# Altium schematic sheet VESC_75100.SchDoc
size A4
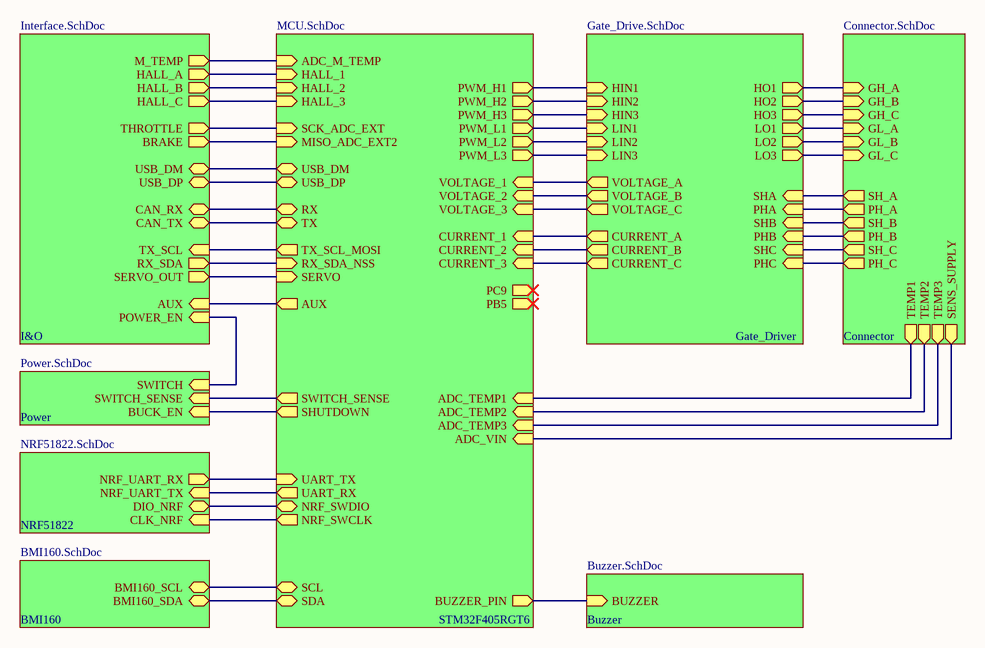
[diagram p0: VESC_75100.SchDoc]

## Sub-sheets
BMI160 = BMI160.SchDoc: BMI160_SCL (bidir), BMI160_SDA (bidir)
Buzzer = Buzzer.SchDoc: BUZZER (in)
Connector = Connector.SchDoc: TEMP1 (out), TEMP2 (out), TEMP3 (out), SH_A (out), SH_B (out), SH_C (out), PH_B (out), PH_C (out), PH_A (out), GL_A (in), GL_B (in), GL_C (in), GH_A (in), GH_B (in), GH_C (in), SENS_SUPPLY (out)
Gate_Driver = Gate_Drive.SchDoc: HIN3 (in), LIN3 (in), LIN1 (in), LIN2 (in), HIN1 (in), HIN2 (in), HO1 (out), HO2 (out), HO3 (out), LO1 (out), LO2 (out), LO3 (out), CURRENT_A (out), CURRENT_B (out), CURRENT_C (out), VOLTAGE_C (out), VOLTAGE_B (out), VOLTAGE_A (out), SHA (in), PHA (in), SHB (in), PHB (in), SHC (in), PHC (in)
I&O = Interface.SchDoc: CAN_TX (bidir), CAN_RX (bidir), USB_DP (bidir), USB_DM (bidir), SERVO_OUT (out), RX_SDA (out), TX_SCL (in), HALL_A (out), HALL_B (out), HALL_C (out), M_TEMP (out), POWER_EN (in), BRAKE (out), THROTTLE (out), AUX (in)
NRF51822 = NRF51822.SchDoc: NRF_UART_RX (out), NRF_UART_TX (in), DIO_NRF (bidir), CLK_NRF (in)
Power = Power.SchDoc: BUCK_EN (in), SWITCH (in), SWITCH_SENSE (in)
STM32F405RGT6 = MCU.SchDoc: ADC_TEMP1 (in), RX_SDA_NSS (in), SCK_ADC_EXT (in), MISO_ADC_EXT2 (in), TX_SCL_MOSI (out), USB_DM (bidir), USB_DP (bidir), ADC_TEMP2 (in), ADC_TEMP3 (in), SERVO (in), RX (bidir), TX (bidir), ADC_VIN (in), ADC_M_TEMP (in), SHUTDOWN (out), HALL_1 (in), HALL_2 (in), HALL_3 (in), PC9 (out), UART_TX (in), UART_RX (out), SDA (bidir), SCL (bidir), PWM_L1 (out), PWM_H1 (out), PWM_L2 (out), PWM_L3 (out), PWM_H2 (out), PWM_H3 (out), VOLTAGE_1 (in), VOLTAGE_2 (in), VOLTAGE_3 (in), CURRENT_1 (in), CURRENT_2 (in), CURRENT_3 (in), NRF_SWDIO (bidir), NRF_SWCLK (out), SWITCH_SENSE (out), BUZZER_PIN (out), AUX (out), PB5 (out)

## Nets
(unnamed): sheet STM32F405RGT6/ADC_TEMP1, sheet Connector/TEMP1
(unnamed): sheet STM32F405RGT6/RX_SDA_NSS, sheet I&O/RX_SDA
(unnamed): sheet STM32F405RGT6/SCK_ADC_EXT, sheet I&O/THROTTLE
(unnamed): sheet STM32F405RGT6/MISO_ADC_EXT2, sheet I&O/BRAKE
(unnamed): sheet STM32F405RGT6/TX_SCL_MOSI, sheet I&O/TX_SCL
(unnamed): sheet STM32F405RGT6/USB_DM, sheet I&O/USB_DM
(unnamed): sheet STM32F405RGT6/USB_DP, sheet I&O/USB_DP
(unnamed): sheet STM32F405RGT6/ADC_TEMP2, sheet Connector/TEMP2
(unnamed): sheet STM32F405RGT6/ADC_TEMP3, sheet Connector/TEMP3
(unnamed): sheet STM32F405RGT6/SERVO, sheet I&O/SERVO_OUT
(unnamed): sheet STM32F405RGT6/RX, sheet I&O/CAN_RX
(unnamed): sheet STM32F405RGT6/TX, sheet I&O/CAN_TX
(unnamed): sheet STM32F405RGT6/ADC_VIN, sheet Connector/SENS_SUPPLY
(unnamed): sheet STM32F405RGT6/ADC_M_TEMP, sheet I&O/M_TEMP
(unnamed): sheet STM32F405RGT6/SHUTDOWN, sheet Power/BUCK_EN
(unnamed): sheet STM32F405RGT6/HALL_1, sheet I&O/HALL_A
(unnamed): sheet STM32F405RGT6/HALL_2, sheet I&O/HALL_B
(unnamed): sheet STM32F405RGT6/HALL_3, sheet I&O/HALL_C
(unnamed): sheet STM32F405RGT6/UART_TX, sheet NRF51822/NRF_UART_RX
(unnamed): sheet STM32F405RGT6/UART_RX, sheet NRF51822/NRF_UART_TX
(unnamed): sheet STM32F405RGT6/SDA, sheet BMI160/BMI160_SDA
(unnamed): sheet STM32F405RGT6/SCL, sheet BMI160/BMI160_SCL
(unnamed): sheet STM32F405RGT6/PWM_L1, sheet Gate_Driver/LIN1
(unnamed): sheet STM32F405RGT6/PWM_H1, sheet Gate_Driver/HIN1
(unnamed): sheet STM32F405RGT6/PWM_L2, sheet Gate_Driver/LIN2
(unnamed): sheet STM32F405RGT6/PWM_L3, sheet Gate_Driver/LIN3
(unnamed): sheet STM32F405RGT6/PWM_H2, sheet Gate_Driver/HIN2
(unnamed): sheet STM32F405RGT6/PWM_H3, sheet Gate_Driver/HIN3
(unnamed): sheet STM32F405RGT6/VOLTAGE_1, sheet Gate_Driver/VOLTAGE_A
(unnamed): sheet STM32F405RGT6/VOLTAGE_2, sheet Gate_Driver/VOLTAGE_B
(unnamed): sheet STM32F405RGT6/VOLTAGE_3, sheet Gate_Driver/VOLTAGE_C
(unnamed): sheet STM32F405RGT6/CURRENT_1, sheet Gate_Driver/CURRENT_A
(unnamed): sheet STM32F405RGT6/CURRENT_2, sheet Gate_Driver/CURRENT_B
(unnamed): sheet STM32F405RGT6/CURRENT_3, sheet Gate_Driver/CURRENT_C
(unnamed): sheet STM32F405RGT6/NRF_SWDIO, sheet NRF51822/DIO_NRF
(unnamed): sheet STM32F405RGT6/NRF_SWCLK, sheet NRF51822/CLK_NRF
(unnamed): sheet STM32F405RGT6/SWITCH_SENSE, sheet Power/SWITCH_SENSE
(unnamed): sheet STM32F405RGT6/BUZZER_PIN, sheet Buzzer/BUZZER
(unnamed): sheet STM32F405RGT6/AUX, sheet I&O/AUX
(unnamed): sheet Gate_Driver/HO1, sheet Connector/GH_A
(unnamed): sheet Gate_Driver/HO2, sheet Connector/GH_B
(unnamed): sheet Gate_Driver/HO3, sheet Connector/GH_C
(unnamed): sheet Gate_Driver/LO1, sheet Connector/GL_A
(unnamed): sheet Gate_Driver/LO2, sheet Connector/GL_B
(unnamed): sheet Gate_Driver/LO3, sheet Connector/GL_C
(unnamed): sheet Gate_Driver/SHA, sheet Connector/SH_A
(unnamed): sheet Gate_Driver/PHA, sheet Connector/PH_A
(unnamed): sheet Gate_Driver/SHB, sheet Connector/SH_B
(unnamed): sheet Gate_Driver/PHB, sheet Connector/PH_B
(unnamed): sheet Gate_Driver/SHC, sheet Connector/SH_C
(unnamed): sheet Gate_Driver/PHC, sheet Connector/PH_C
(unnamed): sheet I&O/POWER_EN, sheet Power/SWITCH